# EAGLE design custom PCB rev1 (EAGLE 7.7.0)
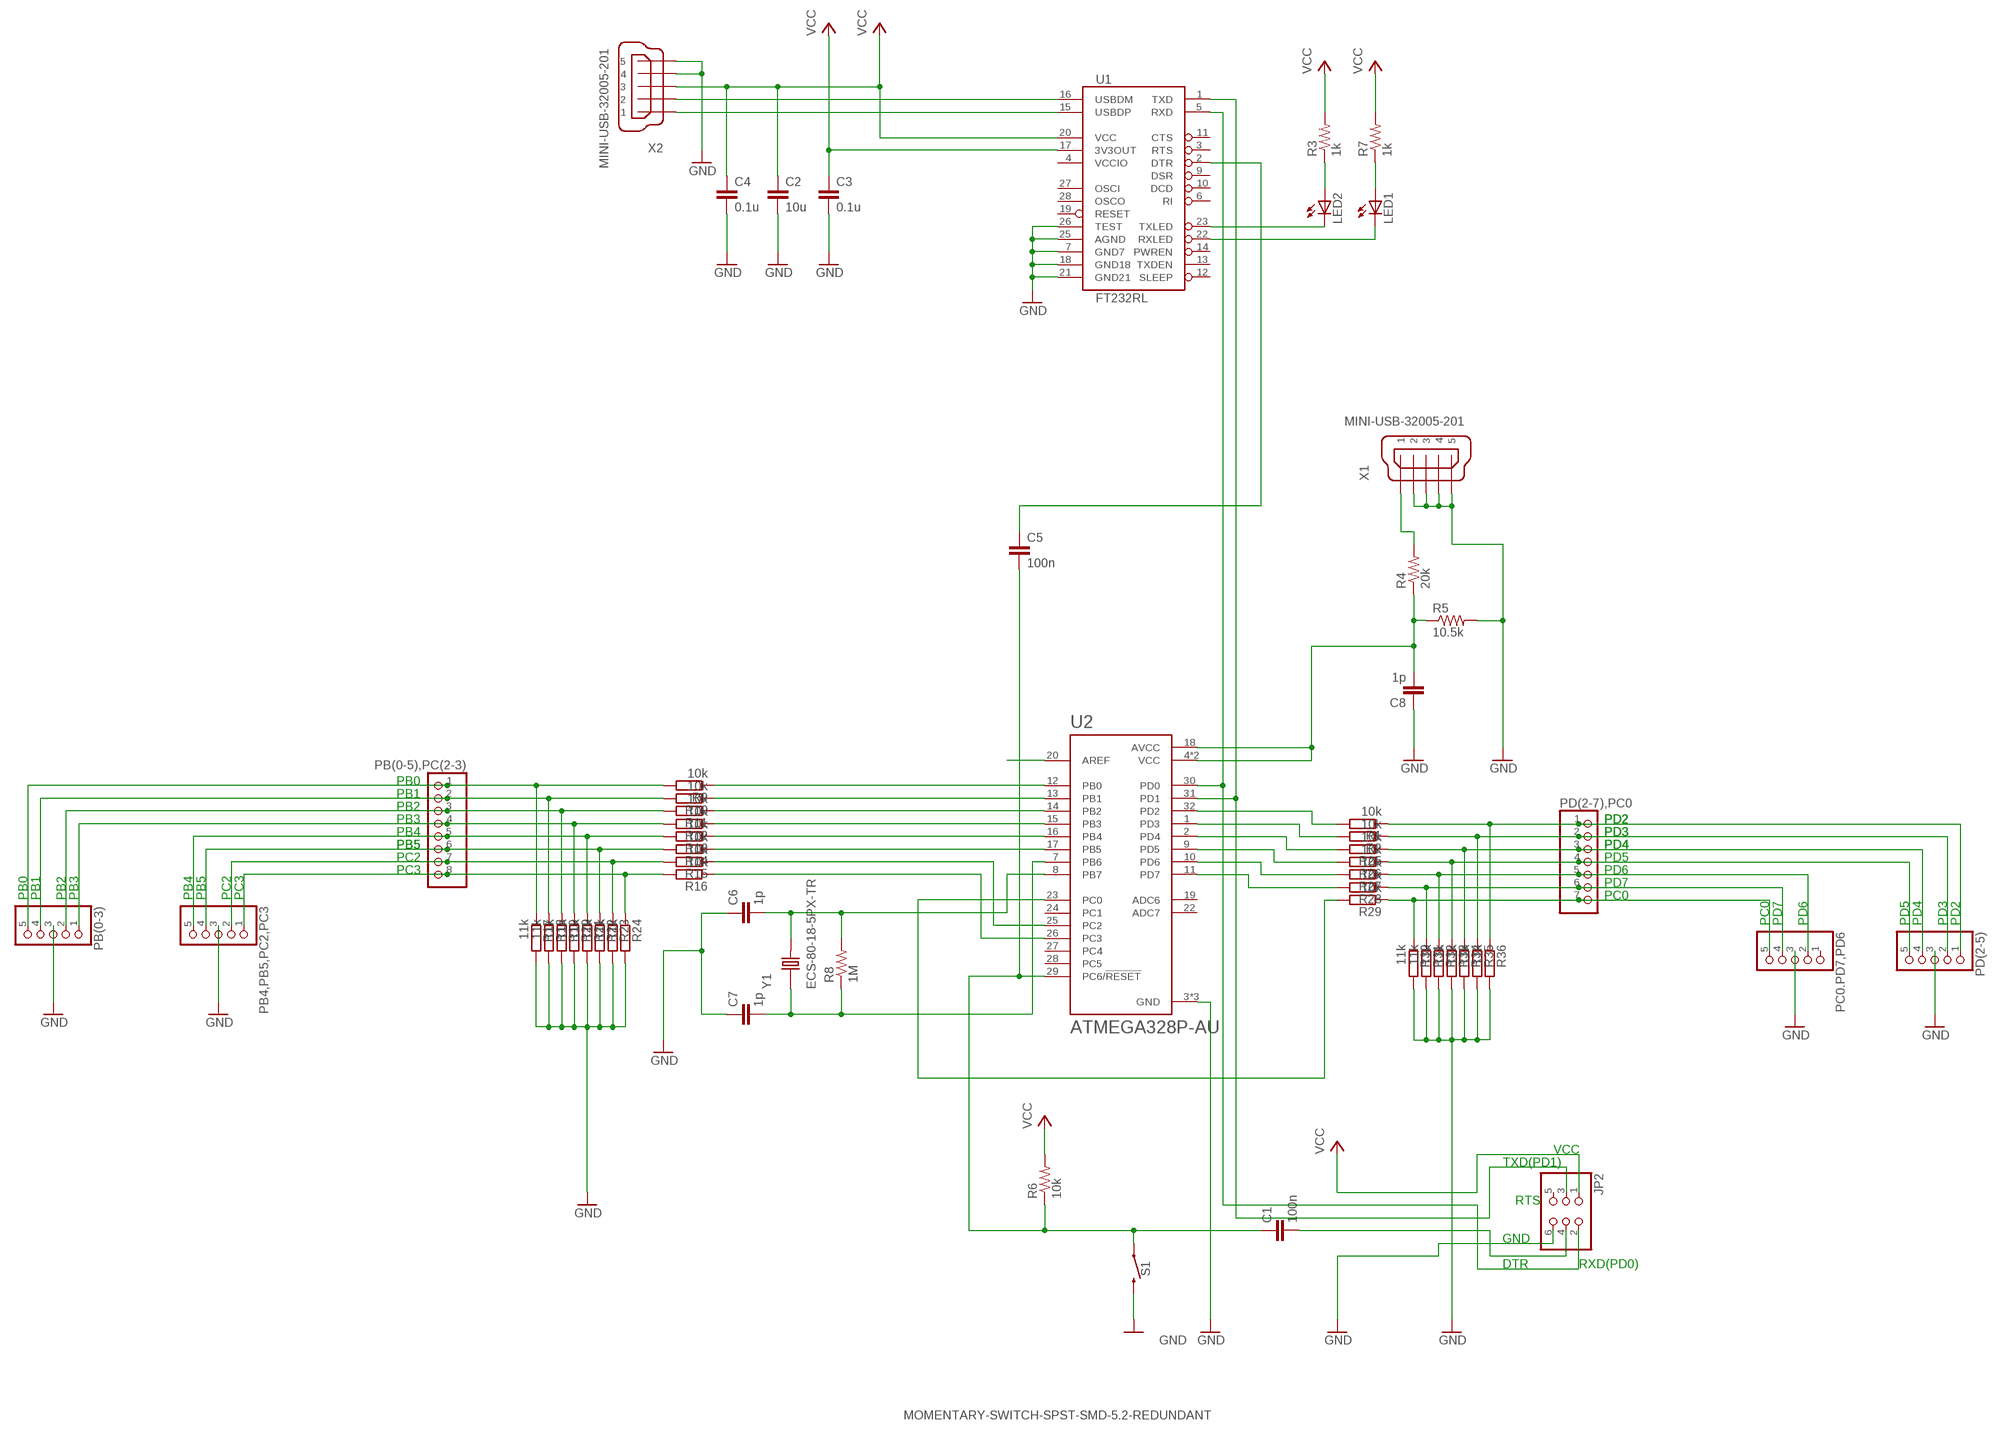
[diagram p0: schematic, sheet 1]

## Parts
C1  100n  C-EUC0603K  [C0603K]
C2  10u  C-EUC0603K  [C0603K]
C3  0.1u  C-EUC0603K  [C0603K]
C4  0.1u  C-EUC0603K  [C0603K]
C5  100n  C-EUC0603K  [C0603K]
C6  1p  C-EUC0603K  [C0603K]
C7  1p  C-EUC0603K  [C0603K]
C8  1p  C-EUC0603K  [C0603K]
JP2  PINHD-2X3  [2X03]
LED1  LEDCHIP-LED0603  [CHIP-LED0603]
LED2  LEDCHIP-LED0603  [CHIP-LED0603]
PB4,PB5,PC2,PC3  PINHD-1X5  [1X05]
PB(0-3)  PINHD-1X5  [1X05]
PB(0-5),PC(2-3)  PINHD-1X8  [1X08]
PC0.PD7,PD6  PINHD-1X5  [1X05]
PD(2-5)  PINHD-1X5  [1X05]
PD(2-7),PC0  PINHD-1X7  [1X07]
R1  10k  RR0402  [R0402]
R2  10k  RR0402  [R0402]
R3  1k  R-US_R0603  [R0603]
R4  20k  R-US_R0603  [R0603]
R5  10.5k  R-US_R0603  [R0603]
R6  10k  R-US_R0603  [R0603]
R7  1k  R-US_R0603  [R0603]
R8  1M  R-US_R0603  [R0603]
R9  10k  RR0402  [R0402]
R10  10k  RR0402  [R0402]
R11  10k  RR0402  [R0402]
R12  10k  RR0402  [R0402]
R13  10k  RR0402  [R0402]
R14  10k  RR0402  [R0402]
R15  10k  RR0402  [R0402]
R16  10k  RR0402  [R0402]
R17  11k  RR0402  [R0402]
R18  11k  RR0402  [R0402]
R19  11k  RR0402  [R0402]
R20  11k  RR0402  [R0402]
R21  11k  RR0402  [R0402]
R22  11k  RR0402  [R0402]
R23  11k  RR0402  [R0402]
R24  11k  RR0402  [R0402]
R25  10k  RR0402  [R0402]
R26  10k  RR0402  [R0402]
R27  10k  RR0402  [R0402]
R28  10k  RR0402  [R0402]
R29  10k  RR0402  [R0402]
R30  11k  RR0402  [R0402]
R31  11k  RR0402  [R0402]
R32  11k  RR0402  [R0402]
R33  11k  RR0402  [R0402]
R34  11k  RR0402  [R0402]
R35  11k  RR0402  [R0402]
R36  11k  RR0402  [R0402]
S1  MOMENTARY-SWITCH-SPST-SMD-5.2-REDUNDANT  [TACTILE_SWITCH_SMD_5.2MM]
U1  FT232RL  FT232RLSSOP  [SSOP28DB]
U2  ATMEGA328P-AU  [QFP80P900X900X120-32N]
X1  MINI-USB-32005-201  [32005-201]
X2  MINI-USB-32005-201  [32005-201]
Y1  ECS-80-18-5PX-TR  [XTAL_ECS-80-18-5PX-TR]

## Nets
GND: C2.2 C3.2 C4.2 C8.1 JP2.6 PB4,PB5,PC2,PC3.3 PB(0-3).3 PC0.PD7,PD6.3 PD(2-5).3 R30.2 R31.2 R32.2 R33.2 R34.2 R35.2 R36.2 S1.3 S1.4 U1.7(GND7) U1.18(GND18) U1.21(GND21) U1.25(AGND) U1.26(TEST) U2.3(GND) U2.5(GND) U2.21(GND) X2.4 X2.5
N$1: R9.1 U2.12(PB0)
N$2: R10.1 U2.13(PB1)
N$3: R11.1 U2.14(PB2)
N$4: R12.1 U2.15(PB3)
N$5: R13.1 U2.16(PB4)
N$6: R14.1 U2.17(PB5)
N$7: R15.1 U2.25(PC2)
N$8: R16.1 U2.26(PC3)
N$9: PB(0-3).5 PB(0-5),PC(2-3).1 R9.2 R17.1
N$10: PB(0-3).4 PB(0-5),PC(2-3).2 R10.2 R18.1
N$11: PB(0-3).2 PB(0-5),PC(2-3).3 R11.2 R19.1
N$12: PB(0-3).1 PB(0-5),PC(2-3).4 R12.2 R20.1
N$13: PB4,PB5,PC2,PC3.5 PB(0-5),PC(2-3).5 R13.2 R21.1
N$14: PB4,PB5,PC2,PC3.4 PB(0-5),PC(2-3).6 R14.2 R22.1
N$15: PB4,PB5,PC2,PC3.2 PB(0-5),PC(2-3).7 R15.2 R23.1
N$16: PB4,PB5,PC2,PC3.1 PB(0-5),PC(2-3).8 R16.2 R24.1
N$17: R1.2 U2.32(PD2)
N$18: R2.2 U2.1(PD3)
N$19: R25.2 U2.2(PD4)
N$20: R26.2 U2.9(PD5)
N$21: R27.2 U2.10(PD6)
N$22: R28.2 U2.11(PD7)
N$23: R29.2 U2.23(PC0)
N$24: PC0.PD7,PD6.5 PD(2-7),PC0.7 R29.1 R30.1
N$25: PC0.PD7,PD6.4 PD(2-7),PC0.6 R28.1 R31.1
N$26: PC0.PD7,PD6.2 PD(2-7),PC0.5 R27.1 R32.1
N$27: PD(2-5).5 PD(2-7),PC0.4 R26.1 R33.1
N$28: PD(2-5).4 PD(2-7),PC0.3 R25.1 R34.1
N$29: PD(2-5).2 PD(2-7),PC0.2 R2.1 R35.1
N$30: PD(2-5).1 PD(2-7),PC0.1 R1.1 R36.1
N$31: C1.2 JP2.4
N$32: JP2.3 U1.1(TXD) U2.31(PD1)
N$33: C1.1 C5.2 R6.1 S1.1 S1.2 U2.29(PC6/!RESET)
N$34: C8.2 R4.1 R5.1 U2.4(VCC) U2.6(VCC) U2.18(AVCC)
N$35: R5.2 X1.2 X1.3 X1.4 X1.5 ; supply symbol labelled GND
N$36: U2.20(AREF)
N$37: U1.15(USBDP) X2.1
N$38: U1.16(USBDM) X2.2
N$39: LED2.A R3.1
N$40: LED1.A R7.1
N$41: LED2.C U1.23(TXLED)
N$42: LED1.C U1.22(RXLED)
N$43: C6.2 R8.2 U2.8(PB7) Y1.2
N$44: C7.2 R8.1 U2.7(PB6) Y1.1
N$45: C5.1 U1.2(DTR)
N$46: C6.1 C7.1 ; supply symbol labelled GND
N$47: R17.2 R18.2 R19.2 R20.2 R21.2 R22.2 R23.2 R24.2
N$48: R4.2 X1.1
N$49: JP2.2 U1.5(RXD) U2.30(PD0)
VCC: C2.1 C3.1 C4.1 JP2.1 R3.2 R6.2 R7.2 U1.17(3V3OUT) U1.20(VCC) X2.3
Unconnected: JP2.5 PC0.PD7,PD6.1 U1.3(RTS) U1.6(RI) U1.9(DSR) U1.10(DCD) U1.11(CTS) U1.12(SLEEP) U1.13(TXDEN) U1.14(PWREN) U1.19(RESET) U1.27(OSCI) U1.28(OSCO) U2.19(ADC6) U2.22(ADC7) U2.24(PC1) U2.27(PC4) U2.28(PC5)

## Notes on the sheet
- PB0
- PB1
- PB2
- PB3 | PD2 | PD2
- PB4 | PD3 | PD3
- PB5 | PB5 | PD4 | PD4
- PC2 | PD5
- PC3 | PD6
- PD7
- PB0 | PB1 | PB2 | PB3 | PB4 | PB5 | PC2 | PC3 | PC0
- PC0 | PD7 | PD6 | PD5 | PD4 | PD3 | PD2
- VCC
- TXD(PD1)
- RTS
- GND
- DTR | RXD(PD0)

## Power pins joined to a net without a drawn wire
VCCIO: U1.4(VCCIO)

## Library data of the parts
C1-C8 = rcl:C-EU: CAPACITOR, European symbol; SPICEPREFIX: C
JP2 = pinhead:PINHD-2X3: PIN HEADER
LED1 LED2 = led:LED: LED OSRAM: - CHIPLED LG R971, LG N971, LY N971, LG Q971, LY Q971, LO R971, LY R971 LH N974, LH R974 LS Q976, LO Q976, LY Q976 LO Q996 - Hyper CHIPLED LW Q18S LB Q993, LB Q99A, LB R99A - SideLED LS A670, LO A670, LY A670, LG A670, LP A670 LB A673, LV A673, LT A673, LW A673 LH A674 LY A675 LS A676, LA A676, LO A676, LY A676, LW A676 LS A679, LY A679, LG A679 - Hyper Micro SIDELED® LS Y876, LA Y876, LO Y876, LY Y876 LT Y87S - SmartLED LW L88C, LW L88S LB L89C, LB L89S, LG L890 LS L89K, LO L89K, LY L89K LS L896, LA L896, LO L896, LY L896 - TOPLED LS T670, LO T670, LY T670, LG T670, LP T670 LSG T670, LSP T670, LSY T670, LOP T670, LYG T670 LG T671, LOG T671, LSG T671 LB T673, LV T673, LT T673, LW T673 LH T674 LS T676, LA T676, LO T676, LY T676, LB T676, LH T676, LSB T676, LW T676 LB T67C, LV T67C, LT T67C, LS T67K, LO T67K, LY T67K, LW E67C LS E67B, LA E67B, LO E67B, LY E67B, LB E67C, LV E67C, LT E67C LW T67C LS T679, LY T679, LG T679 LS T770, LO T770, LY T770, LG T770, LP T770 LB T773, LV T773, LT T773, LW T773 LH T774 LS E675, LA E675, LY E675, LS T675 LS T776, LA T776, LO T776, LY T776, LB T776 LHGB T686 LT T68C, LB T68C - Hyper Mini TOPLED® LB M676 - Mini TOPLED Santana® LG M470 LS M47K, LO M47K, LY M47K Source: http://www.osram.convergy.de LUXEON: - LUMILED® LXK2-PW12-R00, LXK2-PW12-S00, LXK2-PW14-U00, LXK2-PW14-V00 LXK2-PM12-R00, LXK2-PM12-S00, LXK2-PM14-U00 LXK2-PE12-Q00, LXK2-PE12-R00, LXK2-PE12-S00, LXK2-PE14-T00, LXK2-PE14-U00 LXK2-PB12-K00, LXK2-PB12-L00, LXK2-PB12-M00, LXK2-PB14-N00, LXK2-PB14-P00, LXK2-PB14-Q00 LXK2-PR12-L00, LXK2-PR12-M00, LXK2-PR14-Q00, LXK2-PR14-R00 LXK2-PD12-Q00, LXK2-PD12-R00, LXK2-PD12-S00 LXK2-PH12-R00, LXK2-PH12-S00 LXK2-PL12-P00, LXK2-PL12-Q00, LXK2-PL12-R00 Source: www.luxeon.com KINGBRIGHT: KA-3528ASYC Source: www.kingbright.com
PB4,PB5,PC2,PC3 PB(0-3) PC0.PD7,PD6 PD(2-5) = pinhead:PINHD-1X5: PIN HEADER
PB(0-5),PC(2-3) = pinhead:PINHD-1X8: PIN HEADER
PD(2-7),PC0 = pinhead:PINHD-1X7: PIN HEADER
R1 R2 R9-R36 = eagle-ltspice:R: RESISTOR, European symbol; SPICEMODEL: NONE; SPICEPREFIX: R
R3-R8 = rcl:R-US_: RESISTOR, American symbol; SPICEPREFIX: R
S1 = SparkFun-Switches:MOMENTARY-SWITCH-SPST: Momentary Switch (Pushbutton) - SPST Normally-open (NO) SPST momentary switches (buttons, pushbuttons). Variants PTH-12MM - 12mm square, through-hole Momentary Pushbutton Switch - 12mm Square <https://www.sparkfun.com/products/9190> (COM-09190) PTH-6.0MM, PTH-6.0MM-KIT - 6.0mm square, through-hole Mini Pushbutton Switch <https://www.sparkfun.com/products/97> (COM-00097) KIT package intended for soldering kit's - only one side of pads' copper is exposed. PTH-RIGHT-ANGLE-KIT - Right-angle, through-hole Right Angle Tactile Button <https://www.sparkfun.com/products/10791> - Used on SparkFun BigTime Watch Kit <https://www.sparkfun.com/products/11734> SMD-12MM - 12mm square, surface-mount Tactile Button - SMD (12mm) <https://www.sparkfun.com/products/12993> (COM-12993) Used on SparkFun PicoBoard <https://www.sparkfun.com/products/11888> SMD-4.5MM - 4.5mm Square Trackball Switch Used on SparkFun Blackberry Trackballer Breakout <https://www.sparkfun.com/products/13169> SMD-4.6MMX2.8MM - 4.60mm x 2.80mm, surface mount Used on SparkFun SAMD21 Mini Breakout <https://www.sparkfun.com/products/13664> SMD-5.2MM, SMD-5.2-REDUNDANT - 5.2mm square, surface-mount Mini Pushbutton Switch - SMD <https://www.sparkfun.com/products/8720> (COM-08720) Used on Arduino Pro Mini <https://www.sparkfun.com/products/11114> REDUNDANT package connects both switch circuits together SMD-6.0X3.5MM - 6.0 x 3.5mm, surface mount Momentary Reset Switch SMD <https://www.sparkfun.com/products/8229> (COM-08229) SMD-6.2MM-TALL - 6.2mm square, surface mount Tactile Button - SMD (6mm) <https://www.sparkfun.com/products/12992> Used on SparkFun Digital Sandbox <https://www.sparkfun.com/products/12651> SMD-RIGHT-ANGLE - Right-angle, surface mount Used on SparkFun Block for Intel® Edison - Arduino <https://www.sparkfun.com/products/13036>; PROD_ID: SWCH-08247; SF_SKU: COM-08720
U1 = SparkFun-IC-Comms:FT232RL: FT232RL USB UART FT232RL 4th Generation USB UART (USB <-> Serial) Controller. Datasheet <http://www.sparkfun.com/datasheets/IC/FT232R_v104.pdf> SparkFun Products Component <https://www.sparkfun.com/products/650> (COM-00650) SparkFun RedBot Mainboard <https://www.sparkfun.com/products/12097> (ROB-12097) SparkFun FTDI Basic Breakout - 5V <https://www.sparkfun.com/products/9716> (DEV-09716) SparkFun FTDI Basic Breakout - 3.3V <https://www.sparkfun.com/products/9873> (DEV-09873) Bus Pirate - v3.6a <https://www.sparkfun.com/products/12942> (TOL-12942) SparkFun USB to Serial Breakout - FT232RL <https://www.sparkfun.com/products/12731> (BOB-12731) SparkFun PicoBoard <https://www.sparkfun.com/products/11888> (WIG-11888) SparkFun RFID USB Reader <https://www.sparkfun.com/products/9963> (SEN-09963) LilyPad FTDI Basic Breakout - 5V <https://www.sparkfun.com/products/10275> (DEV-10275) SparkFun Stepoko <https://www.sparkfun.com/products/13899> (ROB-13899); PROD_ID: IC-00870
U2 = ATMEGA328P-AU:ATMEGA328P-AU: ATmega Series 20 MHz 32 KB Flash 2 KB SRAM 8-Bit Microcontroller - TQFP-32; DESCRIPTION: Microcontroller Mcu, 8 Bit, Atmega, 20mhz, Tqfp-32; DIGI-KEY_PART_NUMBER: ATMEGA328P-AU-ND; DIGI-KEY_PURCHASE_URL: https://www.digikey.com/product-detail/en/microchip-technology/ATMEGA328P-AU/ATMEGA328P-AU-ND/1832260?utm_source=snapeda&utm_medium=aggregator&utm_campaign=symbol; MF: Microchip; MP: ATMEGA328P-AU; PACKAGE: TQFP-32 Microchip
X1 X2 = con-cypressindustries:MINI-USB-: MINI USB-B Conector Source: www.cypressindustries.com; OC_FARNELL: unknown; OC_NEWARK: unknown
Y1 = ECS-80-18-5PX-TR:ECS-80-18-5PX-TR: CRYSTAL SMD; DESCRIPTION: CSM-7XDN Series 8 MHz ±50 ppm 18 pF -40 to +85 °C Surface Mount Crystal; DIGI-KEY_PART_NUMBER: XC1271CT-ND; DIGI-KEY_PURCHASE_URL: https://www.digikey.com/product-detail/en/ecs-inc/ECS-80-18-5PX-TR/XC1271CT-ND/827735?utm_source=snapeda&utm_medium=aggregator&utm_campaign=symbol; MF: ECS Inc.; MP: ECS-80-18-5PX-TR; PACKAGE: HC49/US ECS International

## Board
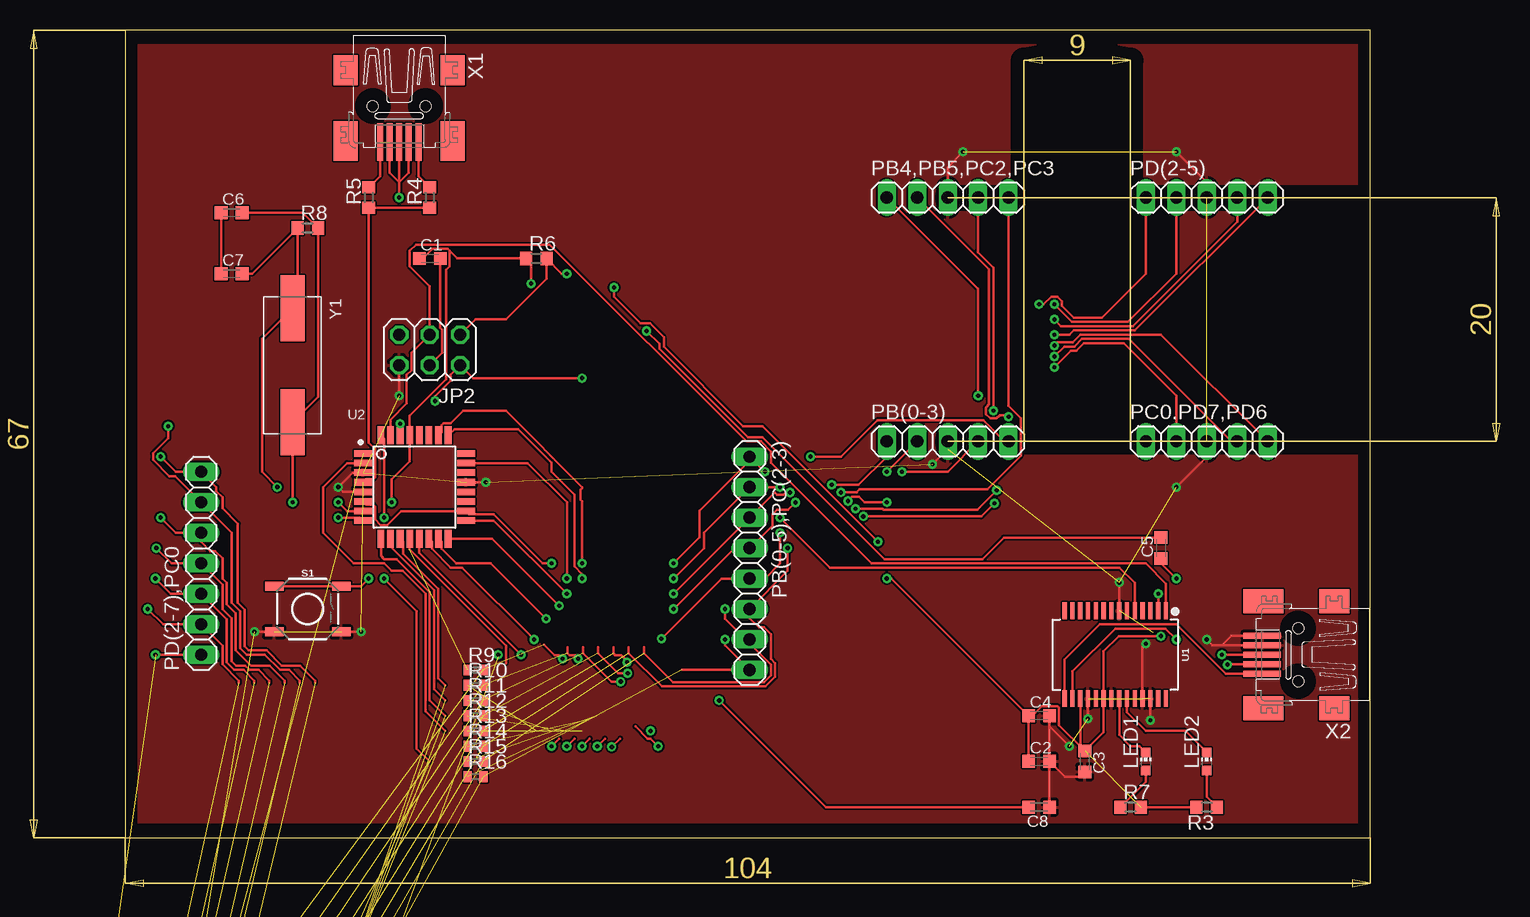
[diagram p1: board, top side]
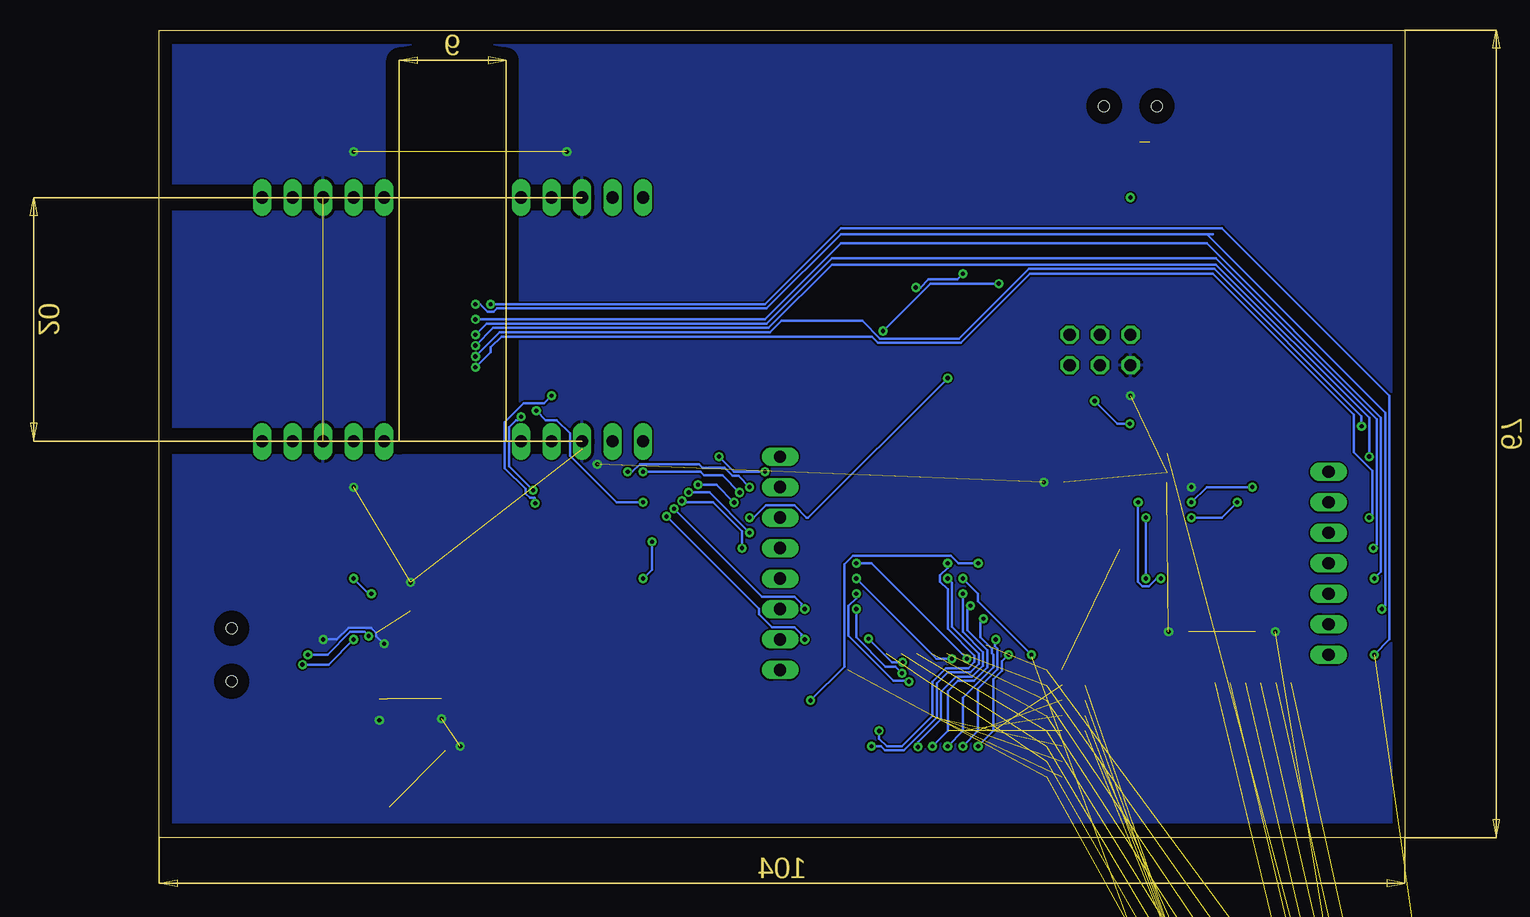
[diagram p2: board, bottom side, seen from below]

Size 103.81 x 67.3 mm. Coordinates in mm from the lower left corner, seen from the top.
Outline: 0,0 103.81,0 103.81,67.3 0,67.3 0,0
Copper layers (1*16): Top 0.035mm / dielectric 1.5mm / Bottom 0.035mm
Design rules "default": minimum track width 6mil, minimum drill 0.35mm, track to track 6mil, track to pad 6mil, pad to pad 6mil, via to via 6mil, smd to smd 6mil, copper to edge 40mil, drill to drill 6mil, minimum pad ring 10mil, minimum via ring 8mil, stop-mask expansion 4mil, vias tented up to drill 0mil, thermal gap 10mil

### Footprints (pad centres in the part's own frame; a part is rotated, then mirrored left to right if it is on the bottom)
C0603K = smd 1.05 x 1.08: 1 -0.875,0; 2 0.875,0
2X03 = drill 1.016 octagon: 1 -2.54,-1.27; 2 -2.54,1.27; 3 0,-1.27; 4 0,1.27; 5 2.54,-1.27; 6 2.54,1.27
CHIP-LED0603 = smd 0.8 x 0.8: A 0,-0.75; C 0,0.75
1X05 = drill 1.016 long: 1 -5.08,0; 2 -2.54,0; 3 0,0; 4 2.54,0; 5 5.08,0
1X08 = drill 1.016 long: 1 -8.89,0; 2 -6.35,0; 3 -3.81,0; 4 -1.27,0; 5 1.27,0; 6 3.81,0; 7 6.35,0; 8 8.89,0
1X07 = drill 1.016 long: 1 -7.62,0; 2 -5.08,0; 3 -2.54,0; 4 0,0; 5 2.54,0; 6 5.08,0; 7 7.62,0
R0402 = smd 0.7 x 0.9: 1 -0.65,0; 2 0.65,0
R0603 = smd 1 x 1.1: 1 -0.85,0; 2 0.85,0
TACTILE_SWITCH_SMD_5.2MM = smd 1.524 x 0.762: 1 -2.794,1.905; 2 2.794,1.905; 3 -2.794,-1.905; 4 2.794,-1.905
SSOP28DB = smd 0.348 x 1.397: 1 -4.225,-3.656; 2 -3.575,-3.656; 3 -2.925,-3.656; 4 -2.275,-3.656; 5 -1.625,-3.656; 6 -0.975,-3.656; 7 -0.325,-3.656; 8 0.325,-3.656; 9 0.975,-3.656; 10 1.625,-3.656; 11 2.275,-3.656; 12 2.925,-3.656; 13 3.575,-3.656; 14 4.225,-3.656; 15 4.225,3.656; 16 3.575,3.656; 17 2.925,3.656; 18 2.275,3.656; 19 1.625,3.656; 20 0.975,3.656; 21 0.325,3.656; 22 -0.325,3.656; 23 -0.975,3.656; 24 -1.625,3.656; 25 -2.275,3.656; 26 -2.925,3.656; 27 -3.575,3.656; 28 -4.225,3.656
QFP80P900X900X120-32N = smd 1.5 x 0.55: 1 -4.3,2.8; 2 -4.3,2; 3 -4.3,1.2; 4 -4.3,0.4; 5 -4.3,-0.4; 6 -4.3,-1.2; 7 -4.3,-2; 8 -4.3,-2.8; 17 4.3,-2.8; 18 4.3,-2; 19 4.3,-1.2; 20 4.3,-0.4; 21 4.3,0.4; 22 4.3,1.2; 23 4.3,2; 24 4.3,2.8 | smd 0.55 x 1.5: 9 -2.8,-4.3; 10 -2,-4.3; 11 -1.2,-4.3; 12 -0.4,-4.3; 13 0.4,-4.3; 14 1.2,-4.3; 15 2,-4.3; 16 2.8,-4.3; 25 2.8,4.3; 26 2,4.3; 27 1.2,4.3; 28 0.4,4.3; 29 -0.4,4.3; 30 -1.2,4.3; 31 -2,4.3; 32 -2.8,4.3
32005-201 = smd 3.1 x 0.5: 1 3,1.6; 2 3,0.8; 3 3,0; 4 3,-0.8; 5 3,-1.6 | smd 2.5 x 2: M1 -3,-4.45; M2 -3,4.45 | smd 3.3 x 2: M3 2.9,4.45; M4 2.9,-4.45 | hole 0.9: 0,2.2; 0,-2.2
XTAL_ECS-80-18-5PX-TR = smd 5.5 x 2: 1 -4.75,0; 2 4.75,0

### Placement (x,y rotation side)
C1  25.4,48.26 0 top
C2  76.2,6.35 0 top
C3  80.01,6.35 270 top
C4  76.2,10.16 0 top
C5  86.36,24.13 90 top
C6  8.89,52.07 0 top
C7  8.89,46.99 0 top
C8  76.2,2.54 180 top
JP2  25.4,40.64 180 top
LED1  85.09,6.35 0 top
LED2  90.17,6.35 0 top
PB4,PB5,PC2,PC3  68.58,53.34 0 top
PB(0-3)  68.58,33.02 0 top
PB(0-5),PC(2-3)  52.07,22.86 270 top
PC0.PD7,PD6  90.17,33.02 0 top
PD(2-5)  90.17,53.34 0 top
PD(2-7),PC0  6.35,22.86 90 top
R1  -8.89,-69.85 0 top  (outside the outline)
R2  -8.89,-73.66 0 top  (outside the outline)
R3  90.17,2.54 180 top
R4  25.4,53.34 90 top
R5  20.32,53.34 90 top
R6  34.29,48.26 0 top
R7  83.82,2.54 0 top
R8  15.24,50.8 0 top
R9  29.21,13.97 0 top
R10  29.21,12.7 0 top
R11  29.21,11.43 0 top
R12  29.21,10.16 0 top
R13  29.21,8.89 0 top
R14  29.21,7.62 0 top
R15  29.21,6.35 0 top
R16  29.21,5.08 0 top
R17  -8.89,-39.37 0 top  (outside the outline)
R18  -8.89,-43.18 0 top  (outside the outline)
R19  -8.89,-46.99 0 top  (outside the outline)
R20  -8.89,-50.8 0 top  (outside the outline)
R21  -8.89,-54.61 0 top  (outside the outline)
R22  -8.89,-58.42 0 top  (outside the outline)
R23  -8.89,-62.23 0 top  (outside the outline)
R24  -8.89,-66.04 0 top  (outside the outline)
R25  -8.89,-77.47 0 top  (outside the outline)
R26  -8.89,-81.28 0 top  (outside the outline)
R27  -8.89,-85.09 0 top  (outside the outline)
R28  -8.89,-88.9 0 top  (outside the outline)
R29  -8.89,-92.71 0 top  (outside the outline)
R30  -8.89,-96.52 0 top  (outside the outline)
R31  -8.89,-100.33 0 top  (outside the outline)
R32  -8.89,-104.14 0 top  (outside the outline)
R33  -8.89,-107.95 0 top  (outside the outline)
R34  -8.89,-111.76 0 top  (outside the outline)
R35  -8.89,-115.57 0 top  (outside the outline)
R36  -8.89,-119.38 0 top  (outside the outline)
S1  15.24,19.05 0 top
U1  82.55,15.24 180 top
U2  24.13,29.21 0 top
X1  22.86,60.96 270 top
X2  97.79,15.24 180 top
Y1  13.97,39.37 270 top

### Tracks (layer width: path | path; a pad name or v marks a point on that pad's centre or on a via)
GND  (via drill 0.35)  (21 unrouted)
  Top 0.203: S1.4 v19.68,17.14 | S1.3 v10.79,17.14 | U2.21 v30.08,29.61 | U2.3 18.98,30.41 v17.78,29.21 18.18,28.81 U2.5 | JP2.6 v22.86,36.83 | U1.7 v82.88,21.27 | C2.2 C8.1 | C3.2 79.62,5.08 78.34,5.08 C2.2 | C2.2 C4.2 77.08,9.27 v78.73,7.61 | X2.4 91.44,16.04 | 91.44,16.04 90.64,16.04 v90.17,16.51 | v85.09,16.16 84.83,15.89 U1.25 | U1.18 v80.28,9.89 | U1.26 v85.48,9.78 | PB(0-3).3 68.58,32.38 v67.31,31.11 | v69.85,57.15 68.58,55.88 PB4,PB5,PC2,PC3.3 | v87.63,57.15 90.17,54.61 PD(2-5).3 | PC0.PD7,PD6.3 90.17,31.75 v87.63,29.21 | X2.5 92.24,16.84 91.44,16.04
  Bottom 0.203: v90.17,16.51 89.03,16.51 88.04,17.5 86.17,17.5 85.73,17.05 85.73,16.8 v85.09,16.16
  pour Top: 1.27,66.04 102.87,66.04 102.87,1.27 0,1.27 0,66.04
  pour Bottom: 0,66.04 102.87,66.04 102.87,1.27 0,1.27
N$1  (1 unrouted)
  Top 0.203: 31.75,14.54 31.75,16.01 23.73,24.03 U2.12
N$2  (via drill 0.35)  (1 unrouted)
  Top 0.203: 36.2,8.26 v35.56,7.62 | v33.02,15.24 24.53,23.73 U2.13
  Bottom 0.203: v35.56,7.62 34.29,8.89 34.29,13.18 33.58,13.89 33.58,14.68 v33.02,15.24
N$3  (via drill 0.35)  (1 unrouted)
  Top 0.203: 37.47,8.26 v36.83,7.62 | v34.09,16.51 28.1,22.5 27.15,22.5 25.6,24.05 25.6,24.64 U2.14
  Bottom 0.203: v36.83,7.62 35.56,8.89 35.56,12.41 33.93,14.04 33.93,15.75 34.15,15.96 34.15,16.46 v34.09,16.51
N$4  (via drill 0.35)  (1 unrouted)
  Top 0.203: 38.73,8.26 v38.1,7.62 | v35.11,18.23 30.48,22.86 27.6,22.86 26.4,24.05 26.4,24.64 U2.15
  Bottom 0.203: v38.1,7.62 36.83,8.89 36.83,11.65 34.29,14.19 34.29,15.24 34.43,15.38 34.43,15.75 35.38,16.69 35.38,17.96 v35.11,18.23
N$5  (via drill 0.35)  (1 unrouted)
  Top 0.203: 40.01,8.26 v39.37,7.62 | v36.2,19.31 30.6,24.91 U2.16
  Bottom 0.203: v39.37,7.62 38.1,8.89 38.1,12.2 37.25,13.05 35.93,13.05 34.79,14.19 34.79,15.6 36.47,17.29 36.47,19.04 v36.2,19.31
N$6  (via drill 0.35)  (1 unrouted)
  Top 0.203: 41.28,8.26 v40.58,7.56 | v36.83,20.32 30.74,26.41 U2.17
  Bottom 0.203: v40.58,7.56 40.58,7.95 38.66,9.87 38.66,12.14 37.39,13.41 36.08,13.41 35.14,14.34 35.14,15.45 36.83,17.14 v36.83,20.32
N$7  (via drill 0.35)  (1 unrouted)
  Top 0.203: v44.45,7.62 43.81,8.26 43.55,8.26 42.55,9.27 | U2.25 27.46,34.04 32.77,34.04 35.56,31.25 35.56,30.48 37.47,28.57 37.47,22.6 38.1,21.97 v38.1,21.59
  Bottom 0.203: v44.45,7.62 43.68,7.62 43.33,7.26 41.76,7.26 39.01,10.01 39.01,12.85 38.1,13.76 36.22,13.76 35.5,14.49 35.5,15.3 37.74,17.55 37.74,21.23 v38.1,21.59
N$8  (via drill 0.35)  (1 unrouted)
  Top 0.203: U2.26 26.4,33.78 26.4,34.37 26.55,34.51 27.13,34.51 28.18,35.56 31.75,35.56 38.1,29.21 38.1,29.12 37.96,28.98 37.96,28.17 38.1,28.03 v38.1,22.86
  Bottom 0.203: v43.82,8.89 43.82,8.26 43.18,7.62 41.91,7.62 39.37,10.16 39.37,12.99 38.25,14.12 36.37,14.12 35.85,14.63 35.85,15.16 38.1,17.4 38.1,20.7 38.73,21.33 38.73,21.85 38.1,22.48 v38.1,22.86
N$9  (via drill 0.35)  (2 unrouted)
  Top 0.203: v36.49,14.9 36.17,15.22 35.79,15.22 34.92,16.08 | v45.72,22.86 47.9,25.04 47.9,27.24 52.07,31.41 PB(0-5),PC(2-3).1 53.32,30.5 v53.34,30.5 | v57.15,31.75 59.69,31.75 62.74,34.8 71.54,34.8 73.32,33.02 PB(0-3).5
  Bottom 0.203: v36.49,14.9 44.45,22.86 v45.72,22.86 | v57.15,31.75 55.9,30.5 v53.34,30.5
N$10  (via drill 0.35)  (2 unrouted)
  Top 0.203: v37.76,14.9 37.76,15.01 37.55,15.22 37.06,15.22 36.91,15.37 36.91,15.85 | v45.72,21.59 48.26,24.13 48.26,25.4 PB(0-5),PC(2-3).2 v54.61,29.21 | v64.77,30.48 68.58,30.48 PB(0-3).4
  Bottom 0.203: v37.76,14.9 39.03,14.9 v45.72,21.59 | v54.61,29.21 55.55,30.15 56.05,30.15 56.72,30.82 58.55,30.82 58.84,31.11 63.76,31.11 64.39,30.48 v64.77,30.48
N$11  (via drill 0.35)  (2 unrouted)
  Top 0.203: 38.18,15.85 38.18,15.37 40.55,13 v41.32,13 | v45.72,20.32 PB(0-5),PC(2-3).3 54.16,28.75 54.17,28.75 54.35,28.58 54.87,28.58 55.05,28.75 v55.44,28.75 | v63.5,30.48 PB(0-3).2
  Bottom 0.203: v41.32,13 41.39,13.07 42.6,13.07 46.35,16.82 46.35,19.31 45.72,19.94 v45.72,20.32 | v55.44,28.75 56.87,30.19 58.42,30.19 58.71,30.48 v63.5,30.48
N$12  (via drill 0.35)  (2 unrouted)
  Top 0.203: 39.45,15.85 39.45,15.37 41.12,13.7 v41.91,13.7 | v45.72,19.05 50.8,24.13 PB(0-5),PC(2-3).4 52.1,24.13 53.98,26.01 53.98,26.93 54.35,27.3 55.27,27.3 v55.9,27.93 | v58.91,29.4 61.15,29.4 63.5,31.75 PB(0-3).1
  Bottom 0.203: v41.91,13.7 42.46,14.25 43.29,14.25 45.72,16.69 v45.72,19.05 | v58.91,29.4 57.37,29.4 v55.9,27.93
N$13  (via drill 0.35)  (2 unrouted)
  Top 0.203: 40.72,15.85 40.72,15.37 40.87,15.22 41.36,15.22 41.62,14.95 | 41.62,14.95 41.91,14.66 | 41.62,14.95 41.62,14.84 v41.85,14.61 | v44.71,16.57 49.73,21.59 PB(0-5),PC(2-3).5 53.34,21.59 54.61,22.86 v54.61,25.4 | 61.02,28.76 60.96,28.76 | 60.96,28.76 v59.69,28.76 | 60.96,28.76 61.24,29.04 71.88,29.04 74.68,31.84 74.68,34.95 73.66,35.97 PB4,PB5,PC2,PC3.5
  Bottom 0.203: v41.85,14.61 42.75,14.61 v44.71,16.57 | v59.69,28.76 57.97,28.76 v54.61,25.4
N$14  (via drill 0.35)  (2 unrouted)
  Top 0.203: 41.99,15.85 41.99,15.37 44.76,12.6 53.4,12.6 54.2,13.4 54.2,14.54 53.85,14.89 53.85,16.93 53.25,17.53 52.83,17.53 52.07,18.29 PB(0-5),PC(2-3).6 55.24,22.22 v55.24,24.13 | v60.26,28.05 60.62,28.41 61.16,28.41 61.63,27.94 v63.5,27.94 | PB4,PB5,PC2,PC3.4 71.12,48.76 72.39,47.49 v72.39,35.56
  Bottom 0.203: v60.26,28.05 60.15,27.94 57.65,27.94 55.24,25.53 v55.24,24.13 | v72.39,35.56 71.63,34.8 70.7,34.8 69.6,33.7 69.6,31.84 65.7,27.94 v63.5,27.94
N$15  (via drill 0.35)  (2 unrouted)
  Top 0.203: PB(0-5),PC(2-3).7 52.01,16.57 52.01,16.23 | 43.26,15.85 43.26,15.37 45.67,12.95 53.25,12.95 53.85,13.55 53.85,14.39 52.01,16.23 | v50.02,19.05 50.02,18.22 52.01,16.23 | PB4,PB5,PC2,PC3.2 72.03,47.35 72.03,36.1 71.76,35.82 71.76,35.3 72.13,34.93 72.65,34.93 72.93,35.2 73.66,35.2 v73.66,35.08 | v60.9,27.41 63.14,27.41 63.24,27.31 71.04,27.31 v72.67,28.93
  Bottom 0.203: v60.9,27.41 53.56,20.07 50.89,20.07 50.29,19.47 50.29,19.33 v50.02,19.05 | v73.66,35.08 73.94,34.8 74.08,34.8 74.68,34.2 74.68,30.94 v72.67,28.93
N$16  (via drill 0.35)  (2 unrouted)
  Top 0.203: 46.41,13.97 PB(0-5),PC(2-3).8 50.02,16.02 v50.02,16.51 | PB4,PB5,PC2,PC3.1 71.12,45.72 v71.12,36.83 | v72.48,27.85 71.39,26.76 v61.55,26.76
  Bottom 0.203: v61.55,26.76 53.85,19.07 53.85,18.63 52.75,17.53 50.89,17.53 50.29,16.93 50.29,16.79 v50.02,16.51 | v71.12,36.83 71.76,36.19 73.44,36.19 75.03,34.6 75.03,30.8 73.3,29.06 73.3,28.67 72.93,28.3 72.54,28.3 72.48,28.24 v72.48,27.85
N$17  (via drill 0.35)  (1 unrouted)
  Top 0.203: 25.4,6.35 24.33,7.42 24.33,18.85 v21.59,21.59 | U2.32 21.59,33.25 v21.59,26.67
  Bottom 0.203: v21.59,21.59 v21.59,26.67
N$18  (1 unrouted)
N$19  (1 unrouted)
  Top 0.203: 26.67,8.89 25.04,10.52 25.04,20.3 23.12,22.22 22.23,22.22 21.59,22.86 19.05,22.86 16.51,25.4 16.51,29.21 18.51,31.21 U2.2
N$20  (1 unrouted)
  Top 0.203: 26.67,10.16 25.4,11.43 25.4,20.32 25.39,20.32 25.39,20.45 22.63,23.22 21.59,23.22 21.33,23.48 U2.9
N$21  (1 unrouted)
  Top 0.203: 26.67,11.43 25.76,12.34 25.76,20.59 22.13,24.22 U2.10
N$22  (1 unrouted)
  Top 0.203: U2.11 23.2,24.64 23.2,23.65 26.11,20.74 26.11,13.26 26.67,12.7
N$23  (via drill 0.35)  (1 unrouted)
  Top 0.203: 31.12,15.07 v31.12,15.24 | U2.23 33.56,31.21 36.83,27.94 v36.83,21.59
  Bottom 0.203: v31.12,15.24 35.56,19.68 35.56,20.32 v36.83,21.59
N$24  (via drill 0.35)  (2 unrouted)
  Top 0.203: 15.84,12.9 15.84,13.09 14.61,14.33 13.08,14.33 11.8,15.6 10.31,15.6 9.96,15.95 9.96,18.99 9.39,19.55 9.39,26.17 8.13,27.43 8.13,28.36 7.62,28.87 7.62,29.21 PD(2-7),PC0.7 4.24,30.48 v2.97,31.75 | PC0.PD7,PD6.5 86.36,41.91 79.63,41.91 79,41.28 77.75,41.28 v77.47,41
  Bottom 0.203: v77.47,41 76,42.47 53.05,42.47 47.76,47.76 15.74,47.76 2.97,34.98 v2.97,31.75
N$25  (via drill 0.35)  (2 unrouted)
  Top 0.203: 14.57,12.9 14.57,13.09 13.7,13.97 12.93,13.97 11.66,15.24 10.16,15.24 9.6,15.8 9.6,18.84 8.89,19.55 8.89,25.4 PD(2-7),PC0.6 4.17,30.12 3.7,30.12 2.34,31.49 2.34,32.01 3.6,33.28 v3.6,34.29 | PC0.PD7,PD6.4 92.21,33.02 83.67,41.55 79.78,41.55 79.15,40.92 78.3,40.92 v77.47,40.09
  Bottom 0.203: v77.47,40.09 75.45,42.11 52.9,42.11 51.95,43.06 45.23,43.06 43.75,41.58 37.16,41.58 31.34,47.4 15.89,47.4 3.6,35.11 v3.6,34.29
N$26  (via drill 0.35)  (2 unrouted)
  Top 0.203: 13.3,12.9 13.3,13.09 12.07,14.33 10.54,14.33 9.25,15.62 9.25,18.69 8.48,19.46 8.48,21.23 8.13,21.59 8.13,23.28 7.53,23.88 7.11,23.88 6.35,24.64 PD(2-7),PC0.5 4.24,25.4 v2.97,26.67 | PC0.PD7,PD6.2 87.63,36.83 83.26,41.2 79.93,41.2 79.3,40.57 78.85,40.57 v77.47,39.18
  Bottom 0.203: v77.47,39.18 76.2,40.45 76.2,40.86 75.3,41.76 44.43,41.76 43.9,41.23 37.01,41.23 31.25,46.99 15.98,46.99 4.23,35.24 4.23,32.12 2.69,30.58 2.69,26.95 v2.97,26.67
N$27  (via drill 0.35)  (2 unrouted)
  Top 0.203: 12.03,12.9 12.03,13.09 11.15,13.97 10.39,13.97 10.03,14.33 9.27,14.33 8.89,14.7 8.89,18.28 8.13,19.05 8.13,21.08 PD(2-7),PC0.4 3.88,22.86 v2.61,24.13 | PD(2-5).5 84.18,42.27 79.1,42.27 78.74,41.91 v77.47,41.91
  Bottom 0.203: v77.47,41.91 76.56,42.82 53.19,42.82 47.76,48.26 15.74,48.26 2.34,34.85 2.34,24.41 v2.61,24.13
N$28  (via drill 0.35)  (2 unrouted)
  Top 0.203: 10.76,12.9 10.76,13.09 9.88,13.97 9.12,13.97 8.48,14.61 8.48,18.19 PD(2-7),PC0.3 3.81,20.32 v2.54,21.59 | PD(2-5).4 92.71,51.3 84.03,42.62 78.03,42.62 v77.47,43.18
  Bottom 0.203: v77.47,43.18 53.34,43.18 46.99,49.53 16.51,49.53 1.98,35 1.98,22.15 v2.54,21.59
N$29  (via drill 0.35)  (2 unrouted)
  Top 0.203: 9.49,12.9 9.49,13.09 8.13,14.46 8.13,16 PD(2-7),PC0.2 3.17,17.78 v1.9,19.05 | PD(2-5).2 87.63,46.99 83.62,42.98 78.94,42.98 v77.47,44.45
  Bottom 0.203: v77.47,44.45 77.09,44.45 76.46,43.82 75.94,43.82 75.66,44.09 53.19,44.09 46.99,50.3 16.51,50.3 | 16.51,50.3 16.01,50.3 | 16.51,50.3 1.63,35.41 1.63,19.33 v1.9,19.05
N$30  (via drill 0.35)  (2 unrouted)
  Top 0.203: 6.35,14.78 PD(2-7),PC0.1 v2.54,15.24 | PD(2-5).1 85.09,46.99 81.43,43.33 79.09,43.33 78.1,44.32 78.1,44.71 77.73,45.08 77.21,45.08 76.58,44.45 v76.2,44.45
  Bottom 0.203: v76.2,44.45 53.34,44.45 46.99,50.8 15.24,50.8 1.27,36.83 1.27,16.51 v2.54,15.24
N$31
  Top 0.203: C1.2 26.27,42.47 26.42,42.33 26.42,40.39 JP2.4
N$32
  Top 0.203: U2.31 22.13,34.83 23.49,36.19 23.49,38.56 23.88,38.95 23.88,40.39 JP2.3 25.4,45.96 23.75,47.62 23.75,48.91 24.25,49.41 35.4,49.41 51.79,33.02 53,33.02 53.85,32.17 53.85,31.24 62.23,22.86 85.09,22.86 86.78,21.18 U1.1
N$33  (via drill 0.35)
  Top 0.203: S1.1 S1.2 19.68,20.95 v20.32,21.59 | v22.23,27.94 22.23,29.85 23.73,31.35 U2.29 23.73,35.16 26.77,38.2 26.77,47.33 27.05,47.62 27.05,48.91 | 27.05,48.91 27.7,48.26 R6.1 33.84,47.86 v33.84,46.17 | 27.05,48.91 26.9,49.05 25.64,49.05 24.85,48.26 C1.1 | C5.2 73.27,25 71.48,23.22 63.31,23.22 53.15,33.38 51.94,33.38 44.56,40.75 44.56,41.14 v43.49,42.22
  Bottom 0.203: v20.32,21.59 20.7,21.59 21.33,20.96 21.85,20.96 22.23,21.33 v22.23,27.94 | v43.49,42.22 39.54,46.17 v33.84,46.17
N$34  (via drill 0.35)  (1 unrouted)
  Top 0.203: U2.4 20.1,29.88 20.68,29.88 20.83,30.03 20.83,32.39 20.32,32.9 R5.1 R4.1 | U2.6 20.1,27.74 20.68,27.74 20.83,27.59 20.83,26.53 21.33,26.04 21.85,26.04 23.02,27.21 U2.18 28.7,26.94 30.71,26.94 34.79,22.86 v35.56,22.86 | C8.2 58.42,2.54 v49.53,11.43
  Bottom 0.203: v49.53,11.43 46.71,14.25 46.71,22.77 45.98,23.49 37.84,23.49 37.21,22.86 v35.56,22.86
N$35  (via drill 0.35)  (1 unrouted)
  Top 0.203: X1.5 21.26,55.13 R5.2 | X1.2 23.66,55.41 22.86,54.61 | X1.4 22.06,55.41 22.86,54.61 | X1.3 22.86,54.61 | 22.86,54.61 v22.86,53.34
N$37
  Top 0.203: X2.1 91.77,13.64 87.63,17.78 81.28,17.78 78.33,14.82 U1.15
N$38  (via drill 0.35)
  Top 0.203: X2.2 91.91,14.44 v91.89,14.42 | v87.63,16.51 86.72,17.42 82.55,17.42 78.98,13.85 U1.16
  Bottom 0.203: v91.89,14.42 89.72,14.42 v87.63,16.51
N$39
  Top 0.203: R3.1 90.17,3.39 LED2.A
N$40
  Top 0.203: R7.1 85.09,4.66 LED1.A
N$41
  Top 0.203: LED2.C 88.38,8.89 85.09,8.89 83.53,10.46 U1.23
N$42
  Top 0.203: LED1.C 84.57,7.62 83.82,7.62 82.88,8.56 U1.22
N$43  (via drill 0.35)
  Top 0.203: v13.97,27.94 Y1.2 16.09,36.74 R8.2 14.82,52.07 C6.2 | v17.78,26.67 19.57,26.67 U2.8
  Bottom 0.203: v13.97,27.94 15.24,26.67 v17.78,26.67
N$44  (via drill 0.35)
  Top 0.203: U2.7 18.51,27.21 v17.78,27.94 | v12.7,29.21 11.43,30.48 11.43,41.58 Y1.1 14.39,44.54 R8.1 10.58,46.99 C7.2
  Bottom 0.203: v17.78,27.94 16.51,29.21 v12.7,29.21
N$45  (via drill 0.35)
  Top 0.203: C5.1 86.36,22.86 v87.63,21.59 | v86.14,20.32 86.14,18.91 U1.2
  Bottom 0.203: v87.63,21.59 86.36,20.32 v86.14,20.32
N$46
  Top 0.203: C6.1 C7.1
N$47  (7 unrouted)
N$48
  Top 0.203: X1.1 24.46,55.13 R4.2
N$49  (via drill 0.35)
  Top 0.203: v25.85,36.38 25.85,36.77 27.13,38.05 27.13,38.56 JP2.2 29.01,38.3 v38.1,38.3 | v22.93,34.48 U2.30 | v54.61,26.67 58.78,22.5 68.58,22.5 68.94,22.5 82.91,22.5 84.17,21.23 U1.5
  Bottom 0.203: v25.85,36.38 23.95,34.48 v22.93,34.48 | v38.1,38.3 49.73,26.67 49.87,26.67 50.89,27.69 53.25,27.69 54.27,26.67 v54.61,26.67
VCC  (via drill 0.35)  (1 unrouted)
  Top 0.203: JP2.1 29.21,43.18 31.75,43.18 35.14,46.57 R6.2 36.41,46.99 v36.83,46.99 | C3.1 79.62,7.61 | 79.62,7.61 U1.17 | C2.1 C4.1 | C3.1 81.58,8.79 U1.20 81.58,15.54 82.83,16.79 v86.36,16.79 | 79.62,7.61 79.62,7.62 | C3.1 77.85,9.38 77.85,10.8 77.7,10.95 76.45,10.95 75.65,10.16 C4.1 | R7.2 R3.2 | X2.3 v91.43,15.25 | C4.1 63.9,21.59 v63.5,21.59 | v62.76,24.66 53.13,34.29 51.53,34.29 44.92,40.9 44.92,41.68 43.75,42.85 42.97,42.85 40.76,45.06 v40.76,45.84
  Bottom 0.203: v91.43,15.25 89.79,15.25 87.89,17.14 86.71,17.14 v86.36,16.79 | v63.5,21.59 62.76,22.33 v62.76,24.66 | v40.76,45.84 40.37,45.84 39.68,46.52 37.3,46.52 v36.83,46.99